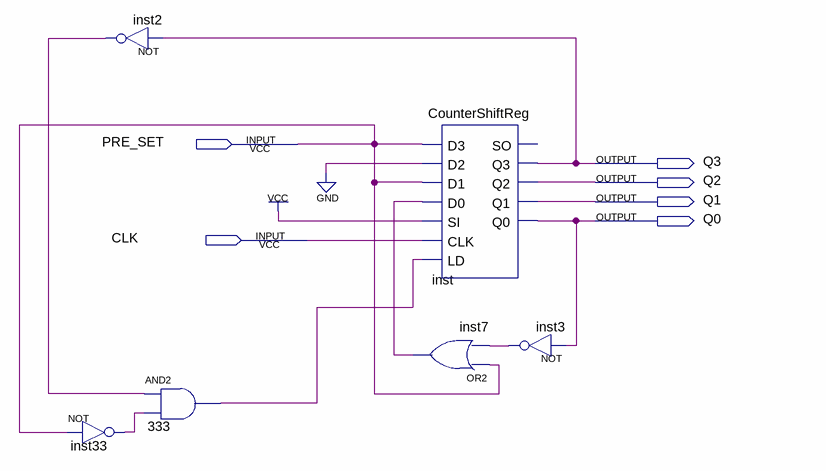
[diagram p0: schematic sheet]
// Quartus schematic CounterShiftRegDemo.bdf as structural Verilog: 6 symbols, 6 pins
module CounterShiftRegDemo (
  input  PRE_SET,
  input  CLK,
  output Q3,
  output Q2,
  output Q1,
  output Q0
);

  wire inst2_out, inst3_out, inst7_out, inst33_out, n333_out;

  not inst33 (inst33_out, PRE_SET);
  not inst2 (inst2_out, Q3);
  and u_333 (n333_out, inst2_out, inst33_out);
  CounterShiftReg inst (
    .CLK(CLK), .D0(inst7_out), .D1(PRE_SET), .D2(1'b0), .D3(PRE_SET), .LD(n333_out), .SI(1'b1), .Q0(Q0),
    .Q1(Q1), .Q2(Q2), .Q3(Q3));  // open: SO
  or inst7 (inst7_out, PRE_SET, inst3_out);
  not inst3 (inst3_out, Q0);
endmodule
